# EAGLE design app_jalousie_up_v0_3 (EAGLE 5.04)
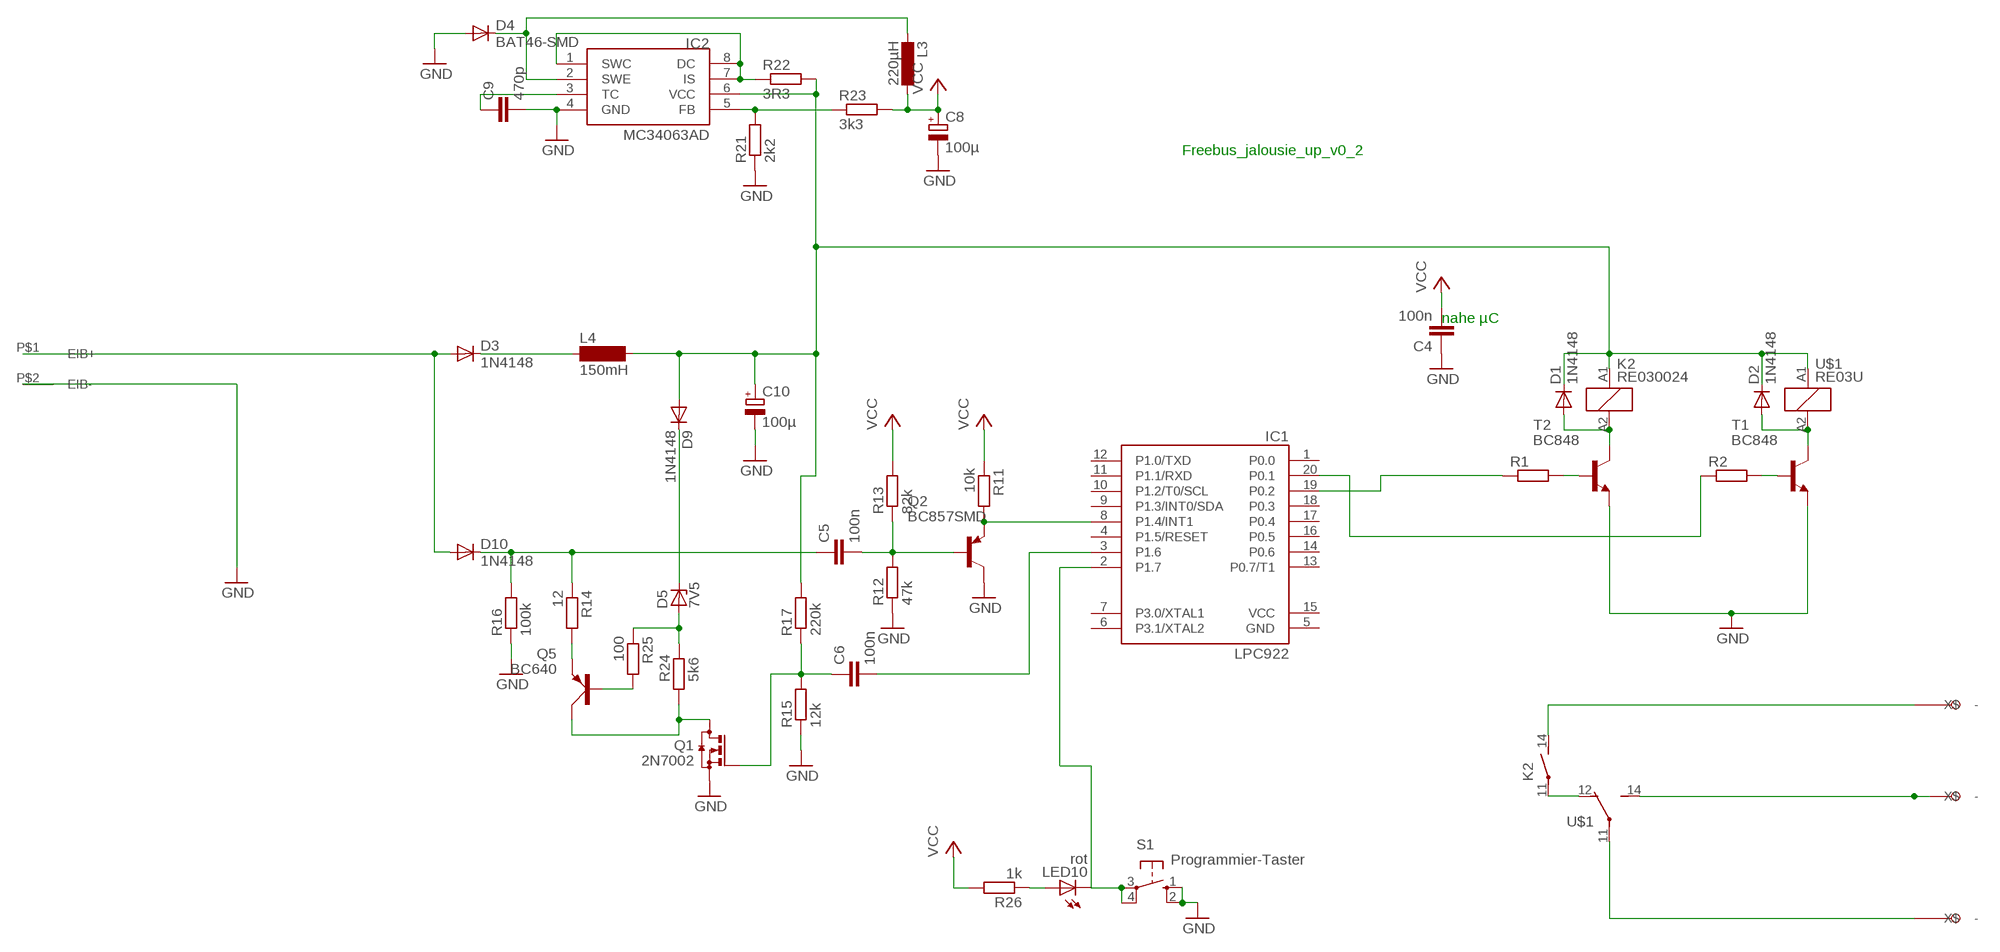
[diagram p0: schematic, sheet 1]

## Parts
C4  100n  C-EUC0805  [C0805]
C5  100n  C-EUC0603K  [C0603K]
C6  100n  C-EUC0603K  [C0603K]
C8  100µ  CPOL-EUE2.5-6  [E2,5-6]
C9  470p  C-EUC0603K  [C0603K]
C10  100µ  CPOL-EUE5-8.5  [E5-8,5]
D1  1N4148  DIODE-SOD80C  [SOD80C]
D2  1N4148  DIODE-SOD80C  [SOD80C]
D3  1N4148  DIODE-SOD80C  [SOD80C]
D4  BAT46-SMD  DIODE-SOD80C  [SOD80C]
D5  7V5  ZENER-DIODESOD80C  [SOD80C]
D9  1N4148  DIODE-SOD80C  [SOD80C]
D10  1N4148  DIODE-SOD80C  [SOD80C]
DOWN  SCHRAUBKLEMME  [SCHRAUBKLEMME_PAC]
IC1  LPC922  [TSSOP20]
IC2  MC34063AD  [SOIC8]
K2  RE030024  [RE-SCHRACK]
L1  SCHRAUBKLEMME  [SCHRAUBKLEMME_PAC]
L3  220µH  L-EU0207/2V  [0207/2V]
L4  150mH  SD12-1000  [SD12_1000]
LED10  rot  LED3MM  [LED3MM]
Q1  2N7002  BSS123  [SOT23]
Q2  BC857SMD  BC857ALT1SMD  [SOT23-BEC]
Q5  BC640  [SOT54D]
R1  R-EU_M0805  [M0805]
R2  R-EU_M0805  [M0805]
R11  10k  R-EU_R0805  [R0805]
R12  47k  R-EU_R0805  [R0805]
R13  82k  R-EU_R0805  [R0805]
R14  12  R-EU_R0805  [R0805]
R15  12k  R-EU_R0805  [R0805]
R16  100k  R-EU_R0805  [R0805]
R17  220k  R-EU_R0805  [R0805]
R21  2k2  R-EU_R0805  [R0805]
R22  3R3  R-EU_R0805  [R0805]
R23  3k3  R-EU_R0805  [R0805]
R24  5k6  R-EU_R0805  [R0805]
R25  100  R-EU_R0805  [R0805]
R26  1k  R-EU_R0805  [R0805]
S1  Programmier-Taster  10-XX  [B3F-10XX]
T1  BC848  [SOT23]
T2  BC848  [SOT23]
U$1  RE03U  [G5Q_1_EU]
U$3  BUSKLEMME  [BUSKLEMME]
UP  SCHRAUBKLEMME  [SCHRAUBKLEMME_PAC]

## Nets
GND: C4.1 C8.- C9.2 C10.- D4.A IC2.4(GND) Q1.2(S) Q2.C R12.1 R15.1 R16.1 R21.1 S1.1(S) S1.2(S1) T1.2(E) T2.2(E) U$3.P$2(EIB-)
N$1: K2.11(2:P) U$1.12(14:O)
N$2: L1.P$2(-) U$1.11(14:P)
N$3: DOWN.P$2(-) K2.14(2:S)
N$4: U$1.14(14:S) UP.P$1(X$) UP.P$2(-)
N$5: C10.+ D1.C D2.C D9.A IC2.6(VCC) K2.A1 L4.2 R17.2 R22.2 U$1.A1
N$6: D2.A T1.3(C) U$1.A2
N$7: R2.2 T1.1(B)
N$8: R1.2 T2.1(B)
N$9: D1.A K2.A2 T2.3(C)
N$10: IC1.19(P0.2) R1.1
N$14: IC1.8(P1.4/INT1) Q2.E R11.2
N$17: IC1.2(P1.7) LED10.K(C) S1.3(P) S1.4(P1)
N$19: IC1.20(P0.1) R2.1
N$21: D3.A D10.A U$3.P$1(EIB+)
N$22: C5.2 Q2.B R12.2 R13.1
N$23: C6.2 IC1.3(P1.6)
N$24: C5.1 D10.C R14.1 R16.2
N$27: IC2.5(FB) R21.2 R23.1
N$28: IC2.1(SWC) IC2.7(IS) IC2.8(DC) R22.1
N$34: C6.1 Q1.1(G) R15.2 R17.1
N$36: D4.C IC2.2(SWE) L3.2
N$37: C9.1 IC2.3(TC)
N$39: D3.C L4.1
N$40: Q1.3(D) Q5.C R24.1
N$41: D5.A R24.2 R25.1
N$42: Q5.E R14.2
N$43: Q5.B R25.2
N$61: D5.C D9.C
N$62: LED10.A R26.1
VCC: C4.2 C8.+ L3.1 R11.1 R13.2 R23.2 R26.2
Unconnected: DOWN.P$1(X$) IC1.1(P0.0) IC1.4(P1.5/RESET) IC1.6(P3.1/XTAL2) IC1.7(P3.0/XTAL1) IC1.9(P1.3/INT0/SDA) IC1.10(P1.2/T0/SCL) IC1.11(P1.1/RXD) IC1.12(P1.0/TXD) IC1.13(P0.7/T1) IC1.14(P0.6) IC1.16(P0.5) IC1.17(P0.4) IC1.18(P0.3) L1.P$1(X$)

## Notes on the sheet
- Freebus_jalousie_up_v0_2
- nahe µC

## Power pins joined to a net without a drawn wire
GND: IC1.5(GND)
VCC: IC1.15(VCC)

## Library data of the parts
C4-C6 C9 = rcl:C-EU: CAPACITOR, European symbol
C8 C10 = rcl:CPOL-EU: POLARIZED CAPACITOR, European symbol
D1-D4 D9 D10 = diode:DIODE-: DIODE
D5 = diode:ZENER-DIODE: Z-Diode
DOWN L1 UP = freebus:SCHRAUBKLEMME
IC1 = Philips:LPC922
IC2 = mc34063:MC34063
K2 = relay:RE03*: Miniature PCB Relay 1 pole 6 A SCHRACK Source: http://www.schrack.com/.. 5812.pdf
L3 = rcl:L-EU: INDUCTOR, European symbol
L4 = inductor-neosid:SD12: INDUCTOR nominal inductance
LED10 = led:LED: LED OSRAM: - CHIPLED LG R971, LG N971, LY N971, LG Q971, LY Q971, LO R971, LY R971 LH N974, LH R974 LS Q976, LO Q976, LY Q976 LO Q996 - Hyper CHIPLED LW Q18S LB Q993, LB Q99A, LB R99A - SideLED LS A670, LO A670, LY A670, LG A670, LP A670 LB A673, LV A673, LT A673, LW A673 LH A674 LY A675 LS A676, LA A676, LO A676, LY A676, LW A676 LS A679, LY A679, LG A679 - Hyper Micro SIDELED® LS Y876, LA Y876, LO Y876, LY Y876 LT Y87S - SmartLED LW L88C, LW L88S LB L89C, LB L89S, LG L890 LS L89K, LO L89K, LY L89K LS L896, LA L896, LO L896, LY L896 - TOPLED LS T670, LO T670, LY T670, LG T670, LP T670 LSG T670, LSP T670, LSY T670, LOP T670, LYG T670 LG T671, LOG T671, LSG T671 LB T673, LV T673, LT T673, LW T673 LH T674 LS T676, LA T676, LO T676, LY T676, LB T676, LH T676, LSB T676, LW T676 LB T67C, LV T67C, LT T67C, LS T67K, LO T67K, LY T67K, LW E67C LS E67B, LA E67B, LO E67B, LY E67B, LB E67C, LV E67C, LT E67C LW T67C LS T679, LY T679, LG T679 LS T770, LO T770, LY T770, LG T770, LP T770 LB T773, LV T773, LT T773, LW T773 LH T774 LS E675, LA E675, LY E675, LS T675 LS T776, LA T776, LO T776, LY T776, LB T776 LHGB T686 LT T68C, LB T68C - Hyper Mini TOPLED® LB M676 - Mini TOPLED Santana® LG M470 LS M47K, LO M47K, LY M47K Source: http://www.osram.convergy.de - LUMILED® LXK2-PW12-R00, LXK2-PW12-S00, LXK2-PW14-U00, LXK2-PW14-V00 LXK2-PM12-R00, LXK2-PM12-S00, LXK2-PM14-U00 LXK2-PE12-Q00, LXK2-PE12-R00, LXK2-PE12-S00, LXK2-PE14-T00, LXK2-PE14-U00 LXK2-PB12-K00, LXK2-PB12-L00, LXK2-PB12-M00, LXK2-PB14-N00, LXK2-PB14-P00, LXK2-PB14-Q00 LXK2-PR12-L00, LXK2-PR12-M00, LXK2-PR14-Q00, LXK2-PR14-R00 LXK2-PD12-Q00, LXK2-PD12-R00, LXK2-PD12-S00 LXK2-PH12-R00, LXK2-PH12-S00 LXK2-PL12-P00, LXK2-PL12-Q00, LXK2-PL12-R00 Source: www.luxeon.com
Q1 = transistor-small-signal:BSS123: N-CHANNEL MOS FET
Q2 = transistor-pnp:BC857*: PNP Transistror
Q5 = transistor-small-signal:BC640: PNP TRANSISTOR
R1 R2 R11-R17 R21-R26 = rcl:R-EU_: RESISTOR, European symbol
S1 = switch-omron:10-XX: OMRON SWITCH
T1 T2 = transistor:BC848: NPN TRANSISTOR
U$1 = freebus_relay:RE03U
U$3 = freebus:BUSKLEMME

## Board
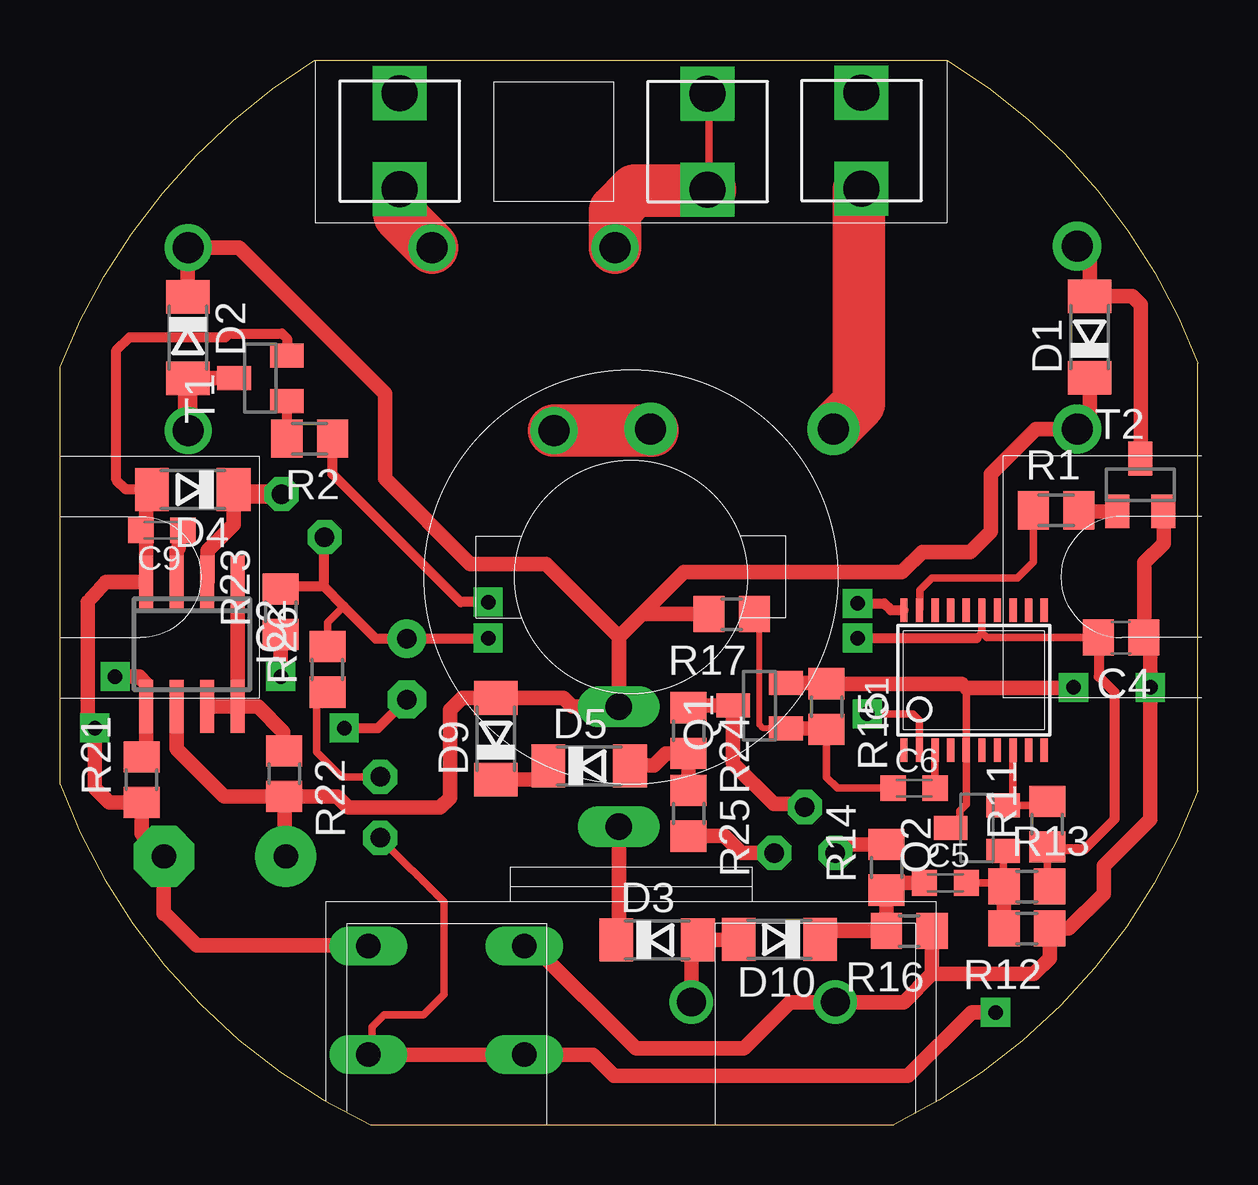
[diagram p1: board, top side]
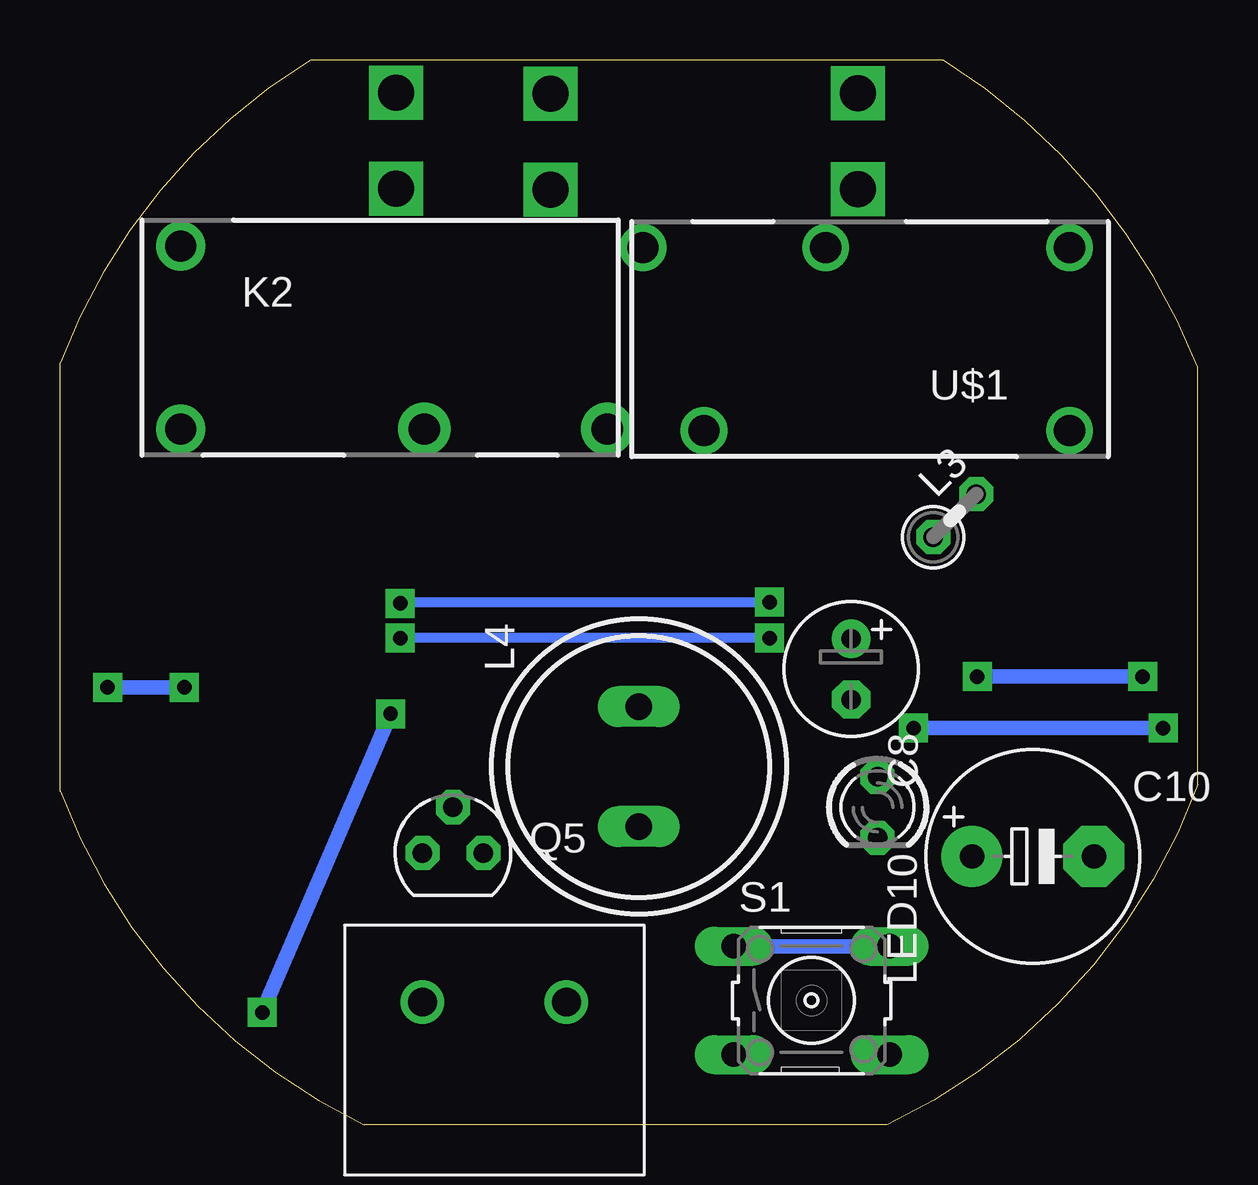
[diagram p2: board, bottom side, seen from below]

Size 47.43 x 44.38 mm. Coordinates in mm from the lower left corner, seen from the top.
Outline: 10.62,44.38 36.96,44.38
Outline: 47.42,13.9 47.43,31.75
Outline: 12.95,0 34.75,0
Outline: 12.95,0 arc-44 0,14.19 0,31.58 arc-36 10.61,44.38
Outline: 36.98,44.38 arc-38 47.43,31.76
Outline: 47.42,13.91 arc-44 34.75,0
Copper layers (1*16): Top 0.035mm / dielectric 1.5mm / Bottom 0.035mm
Design rules "default *": minimum track width 8mil, minimum drill 20mil, track to track 8mil, track to pad 8mil, pad to pad 8mil, via to via 8mil, smd to smd 8mil, copper to edge 30mil, drill to drill 8mil, minimum pad ring 12mil, minimum via ring 12mil, stop-mask expansion 4mil, vias tented up to drill 0mil, thermal gap 10mil

### Footprints (pad centres in the part's own frame; a part is rotated, then mirrored left to right if it is on the bottom)
C0805 = smd 1.3 x 1.5: 1 -0.95,0; 2 0.95,0
C0603K = smd 1.05 x 1.08: 1 -0.875,0; 2 0.875,0
E2,5-6 = drill 0.813 pad 1.6 round: + -1.27,0 | drill 0.813 pad 1.6 octagon: - 1.27,0
E5-8,5 = drill 1.016 pad 2.54 round: + -2.54,0 | drill 1.016 pad 2.54 octagon: - 2.54,0
SOD80C = smd 1.4 x 1.8: A 1.7,0; C -1.7,0
SCHRAUBKLEMME_PAC = drill 1.5 pad 1.93 square: P$1 -2,0; P$2 2,0
TSSOP20 = smd 0.305 x 0.991: 1 -2.925,-2.918; 2 -2.275,-2.918; 3 -1.625,-2.918; 4 -0.975,-2.918; 5 -0.325,-2.918; 6 0.325,-2.918; 7 0.975,-2.918; 8 1.625,-2.918; 9 2.275,-2.918; 10 2.925,-2.918; 11 2.925,2.918; 12 2.275,2.918; 13 1.625,2.918; 14 0.975,2.918; 15 0.325,2.918; 16 -0.325,2.918; 17 -0.975,2.918; 18 -1.625,2.918; 19 -2.275,2.918; 20 -2.925,2.918
SOIC8 = smd 0.6 x 2.2: 1 -1.905,-2.6; 2 -0.635,-2.6; 3 0.635,-2.6; 4 1.905,-2.6; 5 1.905,2.6; 6 0.635,2.6; 7 -0.635,2.6; 8 -1.905,2.6
RE-SCHRACK = drill 1.3 pad 2.184 round: 11 8.89,-3.81; 14 1.27,-3.81 | drill 1.3 pad 2.032 round: A1 -8.89,-3.81; A2 -8.89,3.81
0207/2V = drill 0.813 octagon: 1 -1.27,0; 2 1.27,0
SD12_1000 = drill 1.1 long: 1 -2.5,0; 2 2.5,0
LED3MM = drill 0.813 octagon: A -1.27,0; K 1.27,0
SOT23 = smd 1 x 1.4: 1 -0.95,-1.1; 2 0.95,-1.1; 3 0,1.1
SOT23-BEC = smd 1 x 1.4: B -0.95,-1.1; C 0,1.1; E 0.95,-1.1
SOT54D = drill 0.813 octagon: B 1.27,0; C 0,1.905; E -1.27,0
M0805 = smd 1.3 x 1.6: 1 -0.95,0; 2 0.95,0
R0805 = smd 1.3 x 1.5: 1 -0.95,0; 2 0.95,0
B3F-10XX = drill 1.016 long: 1 -3.251,2.261; 2 3.251,2.261; 3 -3.251,-2.261; 4 3.251,-2.261
G5Q_1_EU = drill 1.3 round: 11 1.27,-3.81; 12 6.35,3.81; 14 8.89,-3.81; A1 -8.89,-3.81; A2 -8.89,3.81
BUSKLEMME = drill 1.2 pad 1.676 round: P$1 0,0; P$2 6,0

### Placement (x,y rotation side)
C4  44.23,20.3 180 top
C5  36.9,10.08 0 top
C6  35.6,14.03 0 top
C8  14.45,19 270 bottom
C9  4.25,24.78 180 top
C10  6.87,11.19 0 bottom
D1  42.92,32.83 90 top
D2  5.33,32.81 270 top
D3  24.89,7.7 0 top
D4  5.54,26.48 180 top
D5  22.06,14.95 0 top
D9  18.17,16.09 90 top
D10  29.99,7.73 180 top
DOWN  33.41,41.02 270 top
IC1  38.1,18.53 0 top
IC2  5.5,20.03 180 top
K2  33.51,32.81 0 bottom
L1  14.16,41 270 top
L3  10.13,25.39 45 bottom
L4  23.3,14.93 90 bottom
LED10  13.35,13.23 270 bottom
Q1  29.16,17.47 90 top
Q2  38.22,12.37 90 top
Q5  31.05,11.33 0 bottom
R1  41.52,25.61 0 top
R2  10.41,28.6 180 top
R11  41.15,12.53 90 top
R12  40.3,8.18 180 top
R13  40.3,9.93 0 top
R14  34.45,10.73 90 top
R15  31.95,17.43 270 top
R16  35.4,8.08 180 top
R17  28,21.28 180 top
R21  3.4,14.38 90 top
R22  9.35,14.63 270 top
R23  9.2,21.38 90 top
R24  26.2,16.43 270 top
R25  26.2,12.98 270 top
R26  11.15,18.98 90 top
S1  16.1,5.18 0 bottom
T1  8.36,31.12 90 top
T2  45.03,26.67 0 top
U$1  14.24,32.75 180 bottom
U$3  26.32,5.11 180 bottom
UP  26.99,40.98 90 top

### Tracks (layer width: path | path; a pad name or v marks a point on that pad's centre or on a via)
GND  (via drill 0.6)
  Top 0.305: Q2.C 37.5,12.75 37.5,13.08 37.77,13.36 IC1.5 37.77,18.21 37.6,18.38
  Top 0.406: v11.85,16.53 13.26,16.53 C8.- | T1.2 9.46,32.77 9.25,32.98 7.05,32.98 6.9,32.83 2.9,32.83 2.35,32.28 2.35,26.88 2.75,26.48 D4.A
  Top 0.61: D4.A 3.6,26.24 3.6,24.98 3.4,24.78 C9.2 3.6,24.56 IC2.4 1.9,22.63 1.15,21.78 1.15,16.83 v1.45,16.53 1.45,14.03 2.05,13.43 R21.1 3.4,12.12 C10.- 4.33,8.8 4.38,8.8 5.7,7.48 12.81,7.48 S1.2 | T2.2 46,25.55 46,24.23 45.2,23.43 45.2,20.32 C4.1 | C4.1 45.5,19.98 | S1.1 19.74,7.44 24,3.18 28.5,3.18 30.43,5.11 U$3.P$2 35.18,5.11 36.35,6.28 | Q1.2 31.91,18.42 R15.1 37.6,18.38 | 37.77,18.21 42.23,18.21 v42.25,18.23 | C4.1 45.45,20.03 v45.45,18.23 45.45,12.73 43.5,10.78 43.5,9.63 42.05,8.18 R12.1 41.25,6.93 40.6,6.28 36.35,6.28 | 36.35,6.28 R16.1
  Bottom 0.61: v1.45,16.53 v11.85,16.53 | S1.2 S1.1 | v45.45,18.23 v42.25,18.23
N$1
  Top 2.184: 24.69,28.94 K2.11 | U$1.12 24.69,28.94 | 24.69,28.94 24.7,28.93
N$2
  Top 2.184: U$1.11 14.16,37.92 L1.P$2
N$3
  Top 2.184: DOWN.P$2 33.36,39.02 33.35,39.03 33.3,38.98 33.3,30.06 K2.14
N$4
  Top 0.305: UP.P$1 26.99,38.89 27.05,38.83 27.05,42.92 UP.P$2
  Top 2.184: U$1.14 23.13,38.11 23.95,38.93 27.05,38.93 27.1,38.98 UP.P$1
N$5
  Top 0.406: L4.2 22.05,17.43
  Top 0.61: R22.2 C10.+ | D1.C 42.92,29.52 K2.A1 40.67,29 38.8,27.13 38.8,24.73 37.95,23.88 35.95,23.88 35.1,23.03 26,23.03 24.25,21.28 | D2.C 5.33,36.54 U$1.A1 7.47,36.56 13.55,30.48 13.55,26.93 17.1,23.38 20.25,23.38 23.3,20.33 | 23.3,20.33 L4.2 21.35,17.43 20.99,17.79 D9.A 16.75,17.78 16.25,17.28 16.25,13.63 15.85,13.23 12,13.23 11.55,13.68 R22.2 | 24.25,21.28 R17.2 | 23.3,20.33 24.25,21.28 | IC2.6 4.87,15.67 6.85,13.68 R22.2
N$6
  Top 0.61: T1.3 D2.A
  Top 0.813: D2.A 5.33,28.96 U$1.A2
N$7
  Top 0.406: R2.2 T1.1
N$8
  Top 0.61: T2.1 42.51,25.57 R1.2
N$9
  Top 0.61: K2.A2 42.92,36.1 D1.A 44.7,34.53 45.05,34.18 45.05,27.79 T2.3
N$10
  Top 0.305: R1.1 40.57,23.45 39.9,22.78 36.35,22.78 35.85,22.28 35.85,21.48 IC1.19
N$14
  Top 0.305: IC1.8 39.73,13.73 Q2.E 41.09,13.32 R11.2
N$17  (via drill 0.6)
  Top 0.305: v33.65,17.13 35.55,17.13 35.82,16.86 IC1.2 | LED10.K 13.35,11.93 16,9.28 16,5.43 15.15,4.58 13.5,4.58 13,4.08 13,3.07 S1.4
  Top 0.61: S1.4 S1.3 22.21,2.92 23.1,2.03 35.35,2.03 38,4.68 v39,4.68
  Bottom 0.61: v39,4.68 v33.65,17.13
N$19  (via drill 0.6)
  Top 0.406: R2.1 11.36,27.12 16.7,21.78 v17.85,21.78 | IC1.20 34.63,21.45 34.35,21.73 v33.25,21.73
  Bottom 0.305: v33.25,21.73 33.25,21.78
  Bottom 0.406: 33.25,21.78 v17.85,21.78
N$21
  Top 0.61: D10.A 28.26,7.7 D3.A 26.32,7.43 U$3.P$1
N$22
  Top 0.305: Q2.B 39.32,9.96 R13.1 39.2,10.08 C5.2
  Top 0.61: R13.1 R12.2
N$23
  Top 0.305: C6.2 IC1.3
N$24
  Top 0.61: D10.C 32.04,8.08 R16.2 R14.1 34.75,10.08 C5.1
N$27  (via drill 0.6)
  Top 0.61: R21.2 3.4,15.48 3.6,15.68 IC2.5 3.6,18.38 3.3,18.68 v2.3,18.68 | v9.2,18.68 R23.1
  Bottom 0.61: v2.3,18.68 v9.2,18.68
N$28
  Top 0.61: IC2.8 7.41,22.08 7.4,22.08 IC2.1 | IC2.8 IC2.7 | IC2.8 8.25,17.43 9.3,16.38 9.3,15.63 R22.1
N$34
  Top 0.254: Q1.1 29.31,16.52 29.15,16.68 29.15,21.08
  Top 0.305: 29.15,21.08 R17.1 | R15.2 31.95,14.48 32.4,14.03 C6.1
  Top 0.61: Q1.1 31.91,16.52 R15.2
N$36
  Top 0.61: D4.C 7.24,25.02 6.15,23.93 6.15,22.65 IC2.2
  Top 0.813: L3.2 7.43,26.29 D4.C
N$37
  Top 0.406: C9.1 4.87,24.52
  Top 0.61: IC2.3 4.87,23.95 4.95,24.03 4.95,24.61 C9.1
N$39
  Top 0.61: L4.1 23.3,7.81 D3.C
N$40
  Top 0.61: R24.1 26.29,17.47 Q1.3 28.06,15.07 29.75,13.38 30.91,13.38 Q5.C
N$41
  Top 0.61: R25.1 R24.2 25.25,15.48 24.75,14.98 23.79,14.98 D5.A
N$42
  Top 0.61: R14.2 32.67,11.68 Q5.E
N$43
  Top 0.61: Q5.B 28.4,11.33 27.7,12.03 R25.2
N$61
  Top 0.61: D9.C 19.8,14.39 D5.C
N$62
  Top 0.305: LED10.A 11.73,14.5 10.7,15.53 10.7,17.58 R26.1
VCC  (via drill 0.6)
  Top 0.305: R11.1 41.15,10.03 R13.2 | 38.42,20.51 IC1.15 | 38.2,20.28 38.42,20.51 | C4.2 38.63,20.3 38.42,20.51 | R26.2 11.15,20.93 11.83,21.61
  Top 0.406: C4.2 43.3,20.28 43.3,18.68 43.95,18.03 43.95,12.73 42.7,11.48 41.25,11.48 R11.1 | 11,22.43 11,24.46 L3.1 | 11,22.43 11.83,21.61 13.17,20.27 C8.+ 17.83,20.27 v17.85,20.28 | v33.25,20.28 38.2,20.28 | 11,22.43 9.3,22.43 R23.2
  Bottom 0.406: v17.85,20.28 v33.25,20.28